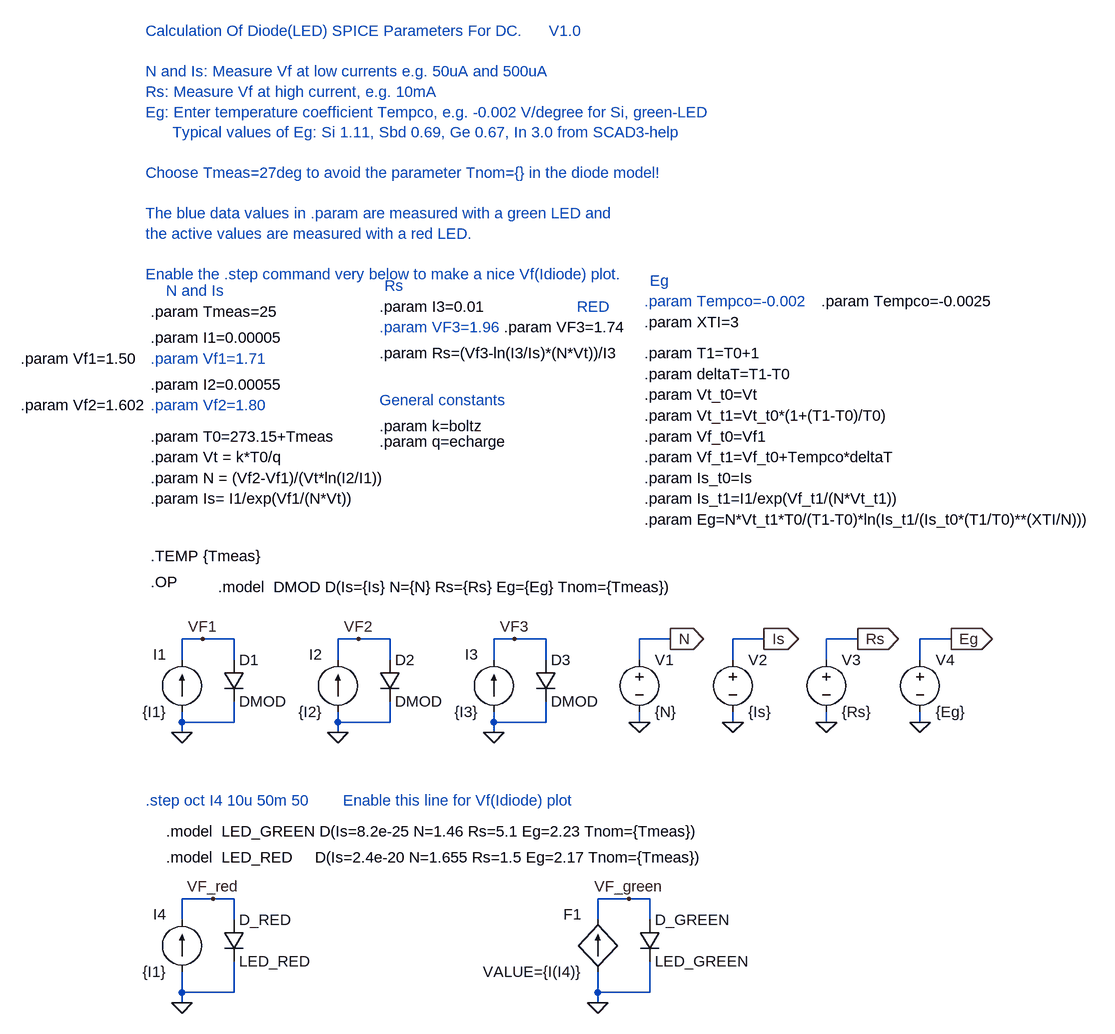
[diagram p0: schematic led_calc.asc]
led_calc.asc, the LTspice schematic file:
Version 4
SHEET 1 1564 680
WIRE -128 -16 -128 -48
WIRE -128 -48 -176 -48
WIRE -208 -48 -208 -16
WIRE -208 64 -208 80
WIRE -208 80 -128 80
WIRE -128 80 -128 48
WIRE -208 96 -208 80
WIRE 112 -16 112 -48
WIRE 112 -48 64 -48
WIRE 32 -48 32 -16
WIRE 32 64 32 80
WIRE 32 80 112 80
WIRE 112 80 112 48
WIRE 32 96 32 80
WIRE 496 80 496 64
WIRE 496 -16 496 -48
WIRE 496 -48 544 -48
WIRE 640 80 640 64
WIRE 640 -16 640 -48
WIRE 640 -48 688 -48
WIRE 784 80 784 64
WIRE 784 -16 784 -48
WIRE 784 -48 832 -48
WIRE 352 -16 352 -48
WIRE 352 -48 304 -48
WIRE 272 -48 272 -16
WIRE 272 64 272 80
WIRE 272 80 352 80
WIRE 352 80 352 48
WIRE 272 96 272 80
WIRE 928 80 928 64
WIRE 928 -16 928 -48
WIRE 928 -48 976 -48
WIRE -128 384 -128 352
WIRE -128 352 -160 352
WIRE -208 352 -208 384
WIRE -208 464 -208 496
WIRE -208 496 -128 496
WIRE -128 496 -128 448
WIRE -208 512 -208 496
WIRE -176 -48 -208 -48
WIRE 64 -48 32 -48
WIRE 304 -48 272 -48
WIRE -160 352 -208 352
WIRE 512 384 512 352
WIRE 512 352 480 352
WIRE 432 352 432 384
WIRE 432 464 432 496
WIRE 432 496 512 496
WIRE 512 496 512 448
WIRE 432 512 432 496
WIRE 480 352 432 352
FLAG -208 96 0
FLAG -176 -48 VF1
FLAG 32 96 0
FLAG 64 -48 VF2
FLAG 496 80 0
FLAG 544 -48 N
IOPIN 544 -48 Out
FLAG 640 80 0
FLAG 688 -48 Is
IOPIN 688 -48 Out
FLAG 784 80 0
FLAG 832 -48 Rs
IOPIN 832 -48 Out
FLAG 272 96 0
FLAG 304 -48 VF3
FLAG 928 80 0
FLAG 976 -48 Eg
IOPIN 976 -48 Out
FLAG -208 512 0
FLAG -160 352 VF_red
FLAG 432 512 0
FLAG 480 352 VF_green
SYMBOL diode -144 -16 R0
SYMATTR InstName D1
SYMATTR Value DMOD
SYMBOL current -208 64 R180
WINDOW 0 24 88 Left 0
WINDOW 3 24 0 Left 0
SYMATTR InstName I1
SYMATTR Value {I1}
SYMBOL diode 96 -16 R0
SYMATTR InstName D2
SYMATTR Value DMOD
SYMBOL current 32 64 R180
WINDOW 0 24 88 Left 0
WINDOW 3 24 0 Left 0
SYMATTR InstName I2
SYMATTR Value {I2}
SYMBOL voltage 496 -32 R0
SYMATTR InstName V1
SYMATTR Value {N}
SYMBOL voltage 640 -32 R0
SYMATTR InstName V2
SYMATTR Value {Is}
SYMBOL voltage 784 -32 R0
SYMATTR InstName V3
SYMATTR Value {Rs}
SYMBOL diode 336 -16 R0
SYMATTR InstName D3
SYMATTR Value DMOD
SYMBOL current 272 64 R180
WINDOW 0 24 88 Left 0
WINDOW 3 24 0 Left 0
SYMATTR InstName I3
SYMATTR Value {I3}
SYMBOL voltage 928 -32 R0
SYMATTR InstName V4
SYMATTR Value {Eg}
SYMBOL diode -144 384 R0
SYMATTR InstName D_RED
SYMATTR Value LED_RED
SYMBOL current -208 464 R180
WINDOW 0 24 88 Left 0
WINDOW 3 24 0 Left 0
SYMATTR InstName I4
SYMATTR Value {I1}
SYMBOL diode 496 384 R0
SYMATTR InstName D_GREEN
SYMATTR Value LED_GREEN
SYMBOL f 432 464 R180
WINDOW 0 24 88 Left 0
WINDOW 3 24 0 Left 0
SYMATTR InstName F1
SYMATTR Value VALUE={I(I4)}
TEXT -256 -296 Left 0 !.param N = (Vf2-Vf1)/(Vt*ln(I2/I1))
TEXT -256 -408 Left 0 ;.param Vf2=1.80
TEXT -256 -480 Left 0 ;.param Vf1=1.71
TEXT -256 -512 Left 0 !.param I1=0.00005
TEXT -256 -440 Left 0 !.param I2=0.00055
TEXT -256 -360 Left 0 !.param T0=273.15+Tmeas
TEXT 504 -488 Left 0 !.param T1=T0+1
TEXT 504 -536 Left 0 !.param XTI=3
TEXT -256 -264 Left 0 !.param Is= I1/exp(Vf1/(N*Vt))
TEXT -256 -328 Left 0 !.param Vt = k*T0/q
TEXT 96 -376 Left 0 !.param k=boltz
TEXT 96 -352 Left 0 !.param q=echarge
TEXT -152 -128 Left 0 !.model  DMOD D(Is={Is} N={N} Rs={Rs} Eg={Eg} Tnom={Tmeas})
TEXT -256 -136 Left 0 !.OP
TEXT 96 -488 Left 0 !.param Rs=(Vf3-ln(I3/Is)*(N*Vt))/I3
TEXT 96 -560 Left 0 !.param I3=0.01
TEXT 96 -528 Left 0 ;.param VF3=1.96
TEXT 504 -264 Left 0 !.param Is_t1=I1/exp(Vf_t1/(N*Vt_t1))
TEXT 504 -392 Left 0 !.param Vt_t1=Vt_t0*(1+(T1-T0)/T0)
TEXT 504 -296 Left 0 !.param Is_t0=Is
TEXT 504 -328 Left 0 !.param Vf_t1=Vf_t0+Tempco*deltaT
TEXT 504 -568 Left 0 ;.param Tempco=-0.002
TEXT 504 -456 Left 0 !.param deltaT=T1-T0
TEXT 504 -424 Left 0 !.param Vt_t0=Vt
TEXT 504 -232 Left 0 !.param Eg=N*Vt_t1*T0/(T1-T0)*ln(Is_t1/(Is_t0*(T1/T0)**(XTI/N)))
TEXT 504 -360 Left 0 !.param Vf_t0=Vf1
TEXT -232 -584 Left 0 ;N and Is
TEXT 104 -592 Left 0 ;Rs
TEXT 512 -600 Left 0 ;Eg
TEXT -232 248 Left 0 !.model  LED_GREEN D(Is=8.2e-25 N=1.46 Rs=5.1 Eg=2.23 Tnom={Tmeas})
TEXT -256 -176 Left 0 !.TEMP {Tmeas}
TEXT -256 -552 Left 0 !.param Tmeas=25
TEXT -264 -984 Left 0 ;Calculation Of Diode(LED) SPICE Parameters For DC.      V1.0\n \nN and Is: Measure Vf at low currents e.g. 50uA and 500uA\nRs: Measure Vf at high current, e.g. 10mA\nEg: Enter temperature coefficient Tempco, e.g. -0.002 V/degree for Si, green-LED\n      Typical values of Eg: Si 1.11, Sbd 0.69, Ge 0.67, In 3.0 from SCAD3-help\n \nChoose Tmeas=27deg to avoid the parameter Tnom={} in the diode model!\n \nThe blue data values in .param are measured with a green LED and \nthe active values are measured with a red LED.\n \nEnable the .step command very below to make a nice Vf(Idiode) plot.
TEXT -232 288 Left 0 !.model  LED_RED     D(Is=2.4e-20 N=1.655 Rs=1.5 Eg=2.17 Tnom={Tmeas})
TEXT 96 -416 Left 0 ;General constants
TEXT -264 200 Left 0 ;.step oct I4 10u 50m 50
TEXT -456 -480 Left 0 !.param Vf1=1.50
TEXT -456 -408 Left 0 !.param Vf2=1.602
TEXT 288 -528 Left 0 !.param VF3=1.74
TEXT 776 -568 Left 0 !.param Tempco=-0.0025
TEXT 400 -560 Left 0 ;RED
TEXT 40 200 Left 0 ;Enable this line for Vf(Idiode) plot

The netlist it stands for:
* led_calc.asc
D1 VF1 0 DMOD
I1 0 VF1 {I1}
D2 VF2 0 DMOD
I2 0 VF2 {I2}
V1 N 0 {N}
V2 Is 0 {Is}
V3 Rs 0 {Rs}
D3 VF3 0 DMOD
I3 0 VF3 {I3}
V4 Eg 0 {Eg}
D_RED VF_red 0 LED_RED
I4 0 VF_red {I1}
D_GREEN VF_green 0 LED_GREEN
F1 0 VF_green VALUE={I(I4)}
.model D D
.lib standard.dio
.param N = (Vf2-Vf1)/(Vt*ln(I2/I1))
* .param Vf2=1.80
* .param Vf1=1.71
.param I1=0.00005
.param I2=0.00055
.param T0=273.15+Tmeas
.param T1=T0+1
.param XTI=3
.param Is= I1/exp(Vf1/(N*Vt))
.param Vt = k*T0/q
.param k=boltz
.param q=echarge
.model  DMOD D(Is={Is} N={N} Rs={Rs} Eg={Eg} Tnom={Tmeas})
.OP
.param Rs=(Vf3-ln(I3/Is)*(N*Vt))/I3
.param I3=0.01
* .param VF3=1.96
.param Is_t1=I1/exp(Vf_t1/(N*Vt_t1))
.param Vt_t1=Vt_t0*(1+(T1-T0)/T0)
.param Is_t0=Is
.param Vf_t1=Vf_t0+Tempco*deltaT
* .param Tempco=-0.002
.param deltaT=T1-T0
.param Vt_t0=Vt
.param Eg=N*Vt_t1*T0/(T1-T0)*ln(Is_t1/(Is_t0*(T1/T0)**(XTI/N)))
.param Vf_t0=Vf1
* N and Is
* Rs
* Eg
.model  LED_GREEN D(Is=8.2e-25 N=1.46 Rs=5.1 Eg=2.23 Tnom={Tmeas})
.TEMP {Tmeas}
.param Tmeas=25
* Calculation Of Diode(LED) SPICE Parameters For DC.      V1.0
* N and Is: Measure Vf at low currents e.g. 50uA and 500uA
* Rs: Measure Vf at high current, e.g. 10mA
* Eg: Enter temperature coefficient Tempco, e.g. -0.002 V/degree for Si, green-LED
*       Typical values of Eg: Si 1.11, Sbd 0.69, Ge 0.67, In 3.0 from SCAD3-help
* Choose Tmeas=27deg to avoid the parameter Tnom={} in the diode model!
* The blue data values in .param are measured with a green LED and
* the active values are measured with a red LED.
* Enable the .step command very below to make a nice Vf(Idiode) plot.
.model  LED_RED     D(Is=2.4e-20 N=1.655 Rs=1.5 Eg=2.17 Tnom={Tmeas})
* General constants
* .step oct I4 10u 50m 50
.param Vf1=1.50
.param Vf2=1.602
.param VF3=1.74
.param Tempco=-0.0025
* RED
* Enable this line for Vf(Idiode) plot
.backanno
.end